# EAGLE schematic Subsystem2 (EAGLE 7.6.0)
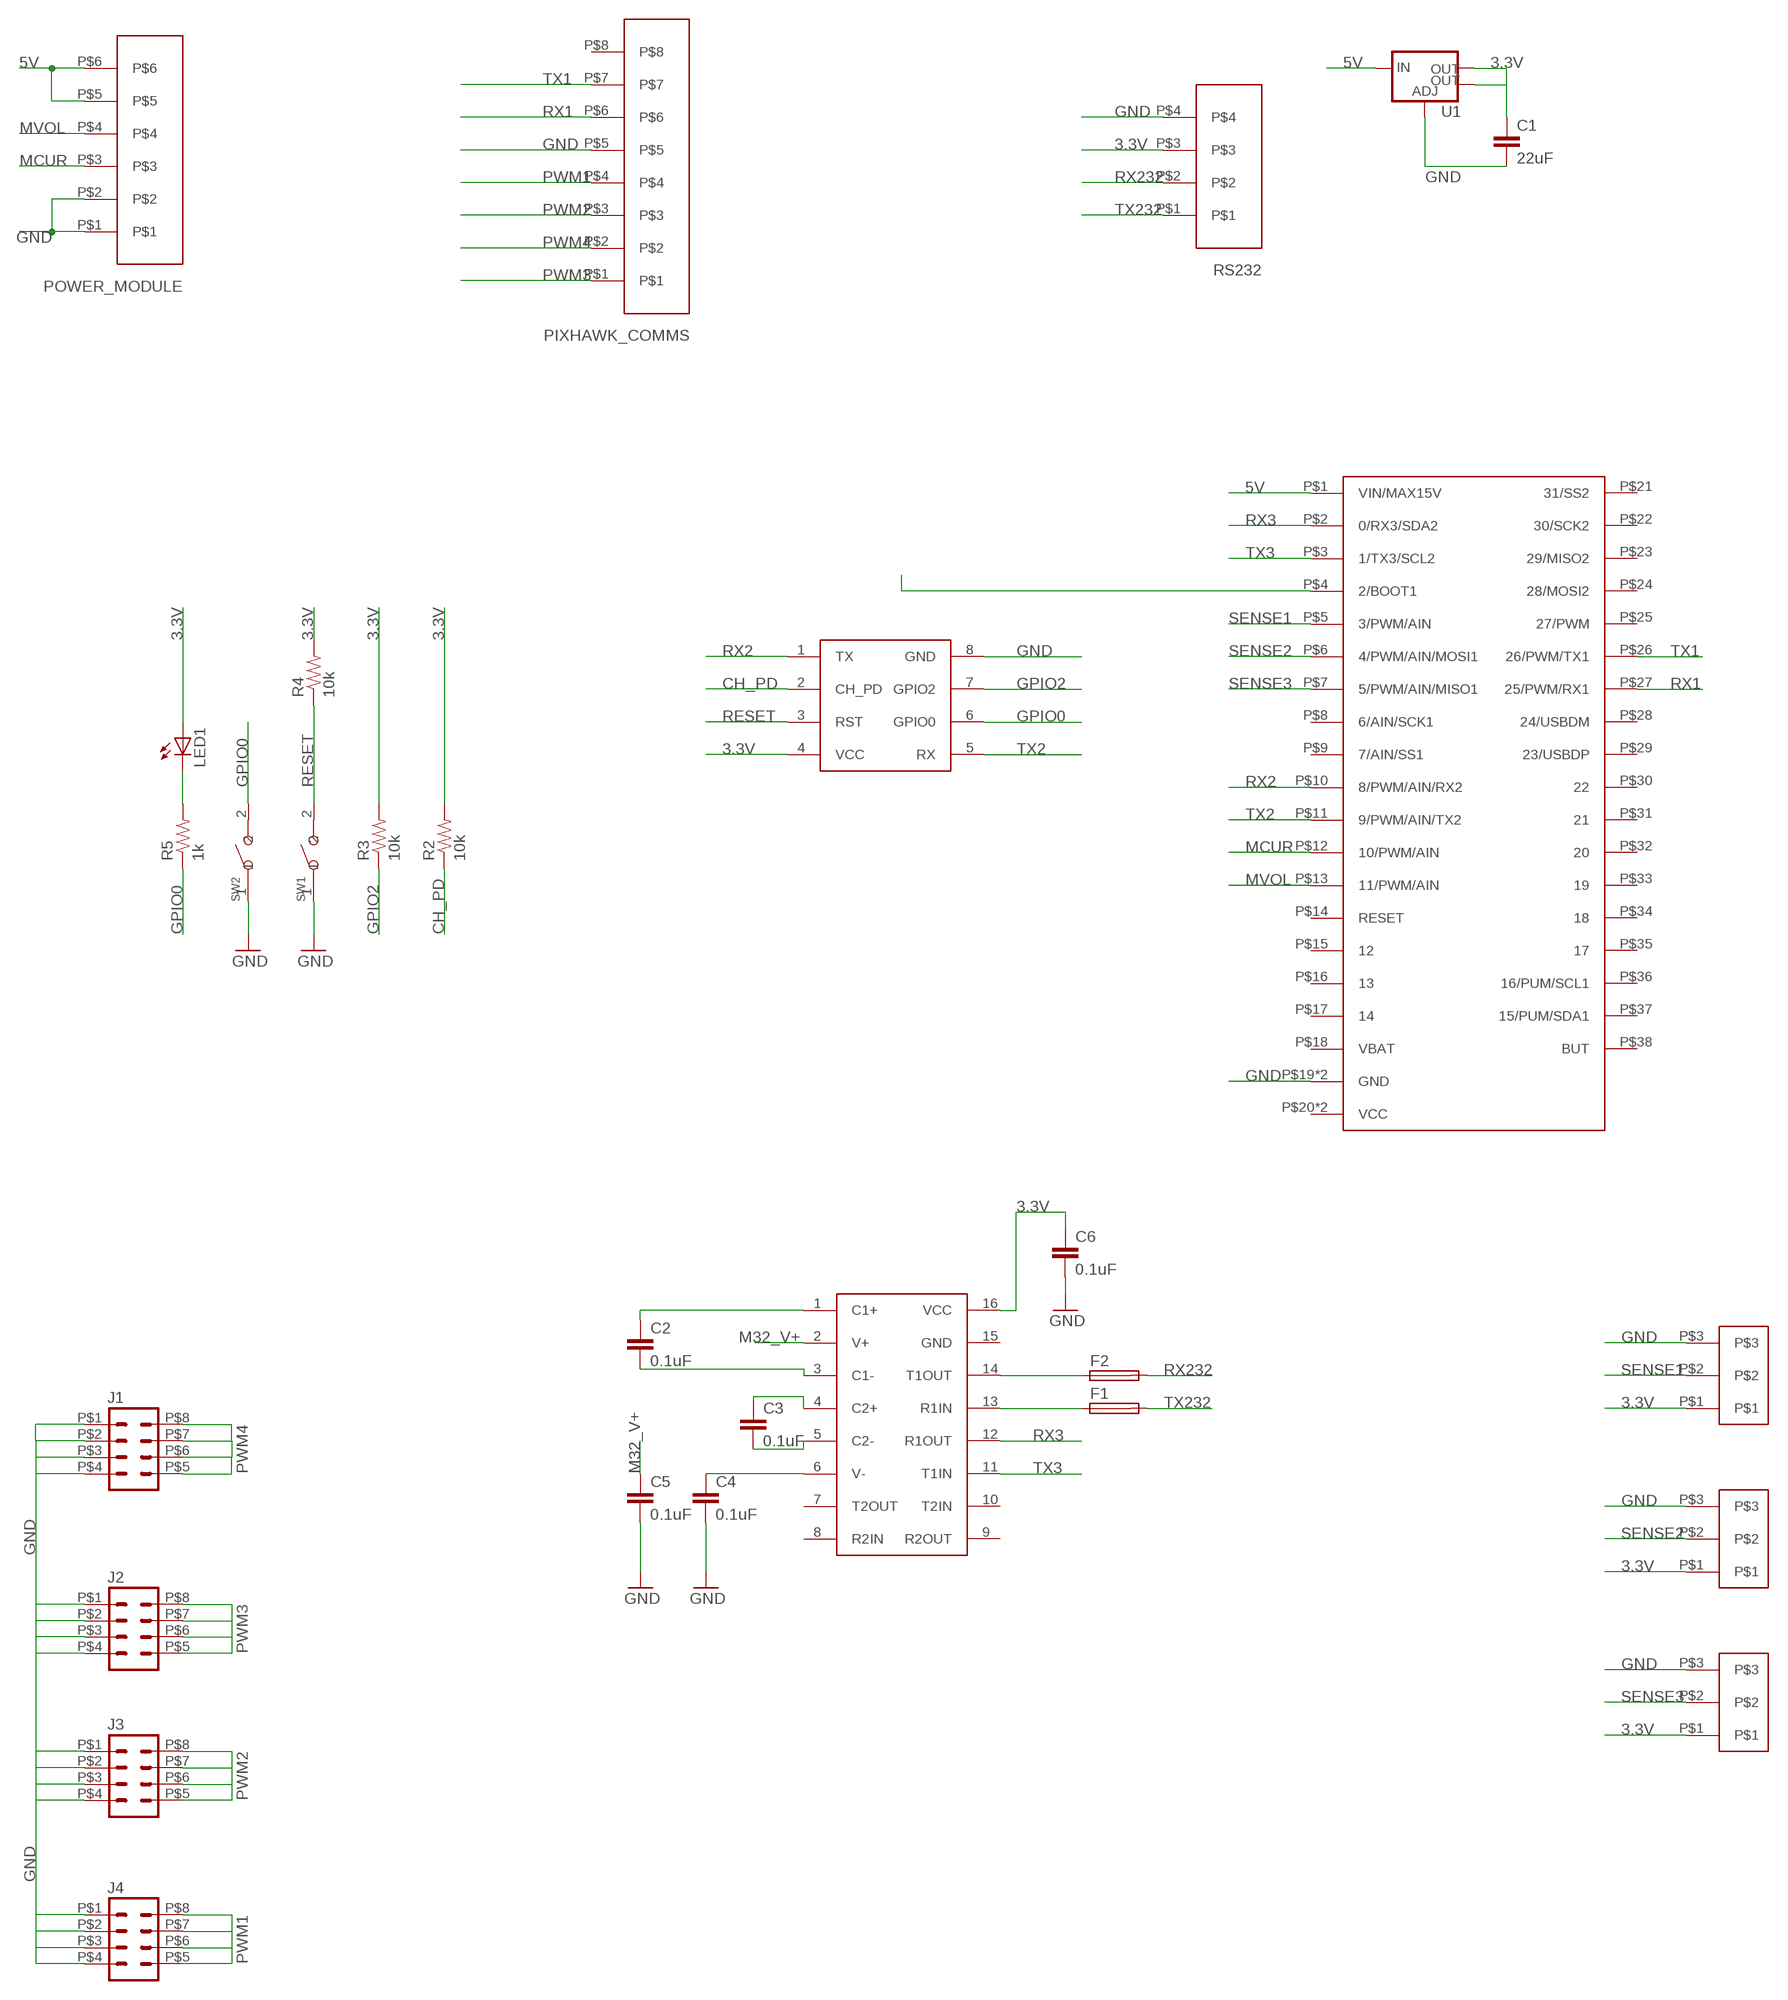
[diagram p0: schematic, sheet 1]

## Parts
C1  22uF  CAP0805  [0805]
C2  0.1uF  CAP0805  [0805]
C3  0.1uF  CAP0805  [0805]
C4  0.1uF  CAP0805  [0805]
C5  0.1uF  CAP0805  [0805]
C6  0.1uF  CAP0805  [0805]
F1  TE5  [TE5]
F2  TE5  [TE5]
J1  M04X2  [2X4]
J2  M04X2  [2X4]
J3  M04X2  [2X4]
J4  M04X2  [2X4]
LED1  LED1206  [LED-1206]
PIXHAWK_COMMS  8PIN-PLUG  [8PIN-PLUG]
POWER_MODULE  6PIN-PLUG  [6PIN-PLUG]
R2  10k  RESISTOR0805-RES  [0805]
R3  10k  RESISTOR0805-RES  [0805]
R4  10k  RESISTOR0805-RES  [0805]
R5  1k  RESISTOR0805-RES  [0805]
RS232  4PIN-PLUG  [4PIN-PLUG]
SW1  SMD-BUTTON(2P-6.0X3.0X2.5MM)-DHT-1163S  [SW2-4.0-6.0X3.0X2.5MM]
SW2  SMD-BUTTON(2P-6.0X3.0X2.5MM)-DHT-1163S  [SW2-4.0-6.0X3.0X2.5MM]
U1  V_REG_LM1117SOT223  [SOT223]
U$1  MAPLE-MINI-SOCKET  [MAPLE-MINI-SOCKET]
U$2  MAX3232  [MAX3232]
U$3  ESP-01  [ESP-01]
U$4  3PIN-PLUG  [3PIN-PLUG]
U$5  3PIN-PLUG  [3PIN-PLUG]
U$6  3PIN-PLUG  [3PIN-PLUG]

## Nets
3.3V: C1.1 C6.1 LED1.A R2.2 R3.2 R4.2 RS232.P$3 U1.2(OUT) U1.4(OUT) U$2.16(VCC) U$3.4(VCC) U$4.P$1 U$5.P$1 U$6.P$1
5V: POWER_MODULE.P$5 POWER_MODULE.P$6 U1.3(IN) U$1.P$1(VIN/MAX15V)
CH_PD: R2.1 U$3.2(CH_PD)
GND: C1.2 C4.2 C5.2 C6.2 J1.P$1 J1.P$2 J1.P$3 J1.P$4 J2.P$1 J2.P$2 J2.P$3 J2.P$4 J3.P$1 J3.P$2 J3.P$3 J3.P$4 J4.P$1 J4.P$2 J4.P$3 J4.P$4 PIXHAWK_COMMS.P$5 POWER_MODULE.P$1 POWER_MODULE.P$2 RS232.P$4 SW1.1 SW2.1 U1.1(ADJ) U$1.P$19(GND) U$1.P$39(GND) U$3.8(GND) U$4.P$3 U$5.P$3 U$6.P$3
GPIO0: R5.1 SW2.2 U$3.6(GPIO0)
GPIO2: R3.1 U$3.7(GPIO2)
M32_C1+: C2.1 U$2.1(C1+)
M32_C1-: C2.2 U$2.3(C1-)
M32_C2+: C3.1 U$2.4(C2+)
M32_C2-: C3.2 U$2.5(C2-)
M32_V+: C5.1 U$2.2(V+)
M32_V-: C4.1 U$2.6(V-)
MCUR: POWER_MODULE.P$3 U$1.P$12(10/PWM/AIN)
MVOL: POWER_MODULE.P$4 U$1.P$13(11/PWM/AIN)
N$2: F2.1 U$2.14(T1OUT)
N$3: F1.1 U$2.13(R1IN)
N$4: LED1.C R5.2
N$5: U$1.P$4(2/BOOT1)
PWM1: J4.P$5 J4.P$6 J4.P$7 J4.P$8 PIXHAWK_COMMS.P$4
PWM2: J3.P$5 J3.P$6 J3.P$7 J3.P$8 PIXHAWK_COMMS.P$3
PWM3: J2.P$5 J2.P$6 J2.P$7 J2.P$8 PIXHAWK_COMMS.P$1
PWM4: J1.P$5 J1.P$6 J1.P$7 J1.P$8 PIXHAWK_COMMS.P$2
RESET: R4.1 SW1.2 U$3.3(RST)
RX1: PIXHAWK_COMMS.P$6 U$1.P$27(25/PWM/RX1)
RX2: U$1.P$10(8/PWM/AIN/RX2) U$3.1(TX)
RX3: U$1.P$2(0/RX3/SDA2) U$2.12(R1OUT)
RX232: F2.2 RS232.P$2
SENSE1: U$1.P$5(3/PWM/AIN) U$4.P$2
SENSE2: U$1.P$6(4/PWM/AIN/MOSI1) U$5.P$2
SENSE3: U$1.P$7(5/PWM/AIN/MISO1) U$6.P$2
TX1: PIXHAWK_COMMS.P$7 U$1.P$26(26/PWM/TX1)
TX2: U$1.P$11(9/PWM/AIN/TX2) U$3.5(RX)
TX3: U$1.P$3(1/TX3/SCL2) U$2.11(T1IN)
TX232: F1.2 RS232.P$1
Unconnected: PIXHAWK_COMMS.P$8 U$1.P$8(6/AIN/SCK1) U$1.P$9(7/AIN/SS1) U$1.P$14(RESET) U$1.P$15 U$1.P$16 U$1.P$17 U$1.P$18(VBAT) U$1.P$20(VCC) U$1.P$21(31/SS2) U$1.P$22(30/SCK2) U$1.P$23(29/MISO2) U$1.P$24(28/MOSI2) U$1.P$25(27/PWM) U$1.P$28(24/USBDM) U$1.P$29(23/USBDP) U$1.P$30 U$1.P$31 U$1.P$32 U$1.P$33 U$1.P$34 U$1.P$35 U$1.P$36(16/PUM/SCL1) U$1.P$37(15/PUM/SDA1) U$1.P$38(BUT) U$1.P$40(VCC) U$2.7(T2OUT) U$2.8(R2IN) U$2.9(R2OUT) U$2.10(T2IN) U$2.15(GND)

## Library data of the parts
C1-C6 = Brendan:CAP: Capacitor Standard 0603 ceramic capacitor, and 0.1" leaded capacitor.
F1 F2 = Brendan:TE5: FUSE Wickmann; OC_FARNELL: unknown; OC_NEWARK: unknown
J1-J4 = Brendan:M04X2: .1" header, two rows of four.
LED1 = Brendan:LED: LEDs Standard schematic elements and footprints for 5mm, 3mm, 1206, and 0603 sized LEDs. 5mm - Spark Fun Electronics SKU : Comp-SBL
PIXHAWK_COMMS = Brendan:8PIN-PLUG
POWER_MODULE = Brendan:6PIN-PLUG
R2-R5 = Brendan:RESISTOR: Resistor Basic schematic elements and footprints for 0603, 1206, and PTH resistors.
RS232 = Brendan:4PIN-PLUG
SW1 SW2 = Brendan:SMD-BUTTON(2P-6.0X3.0X2.5MM): 311020029
U1 = Brendan:V_REG_LM1117: Voltage Regulator LM1117 Standard adjustable voltage regulator but in SMD form. Spark Fun Electronics SKU : COM-00595; PROD_ID: VREG-08170
U$1 = Brendan:MAPLE-MINI-SOCKET
U$2 = Brendan:MAX3232
U$3 = Brendan:ESP-01
U$4-U$6 = Brendan:3PIN-PLUG